# EAGLE design GPIO_Adapter (EAGLE 9.6.2)
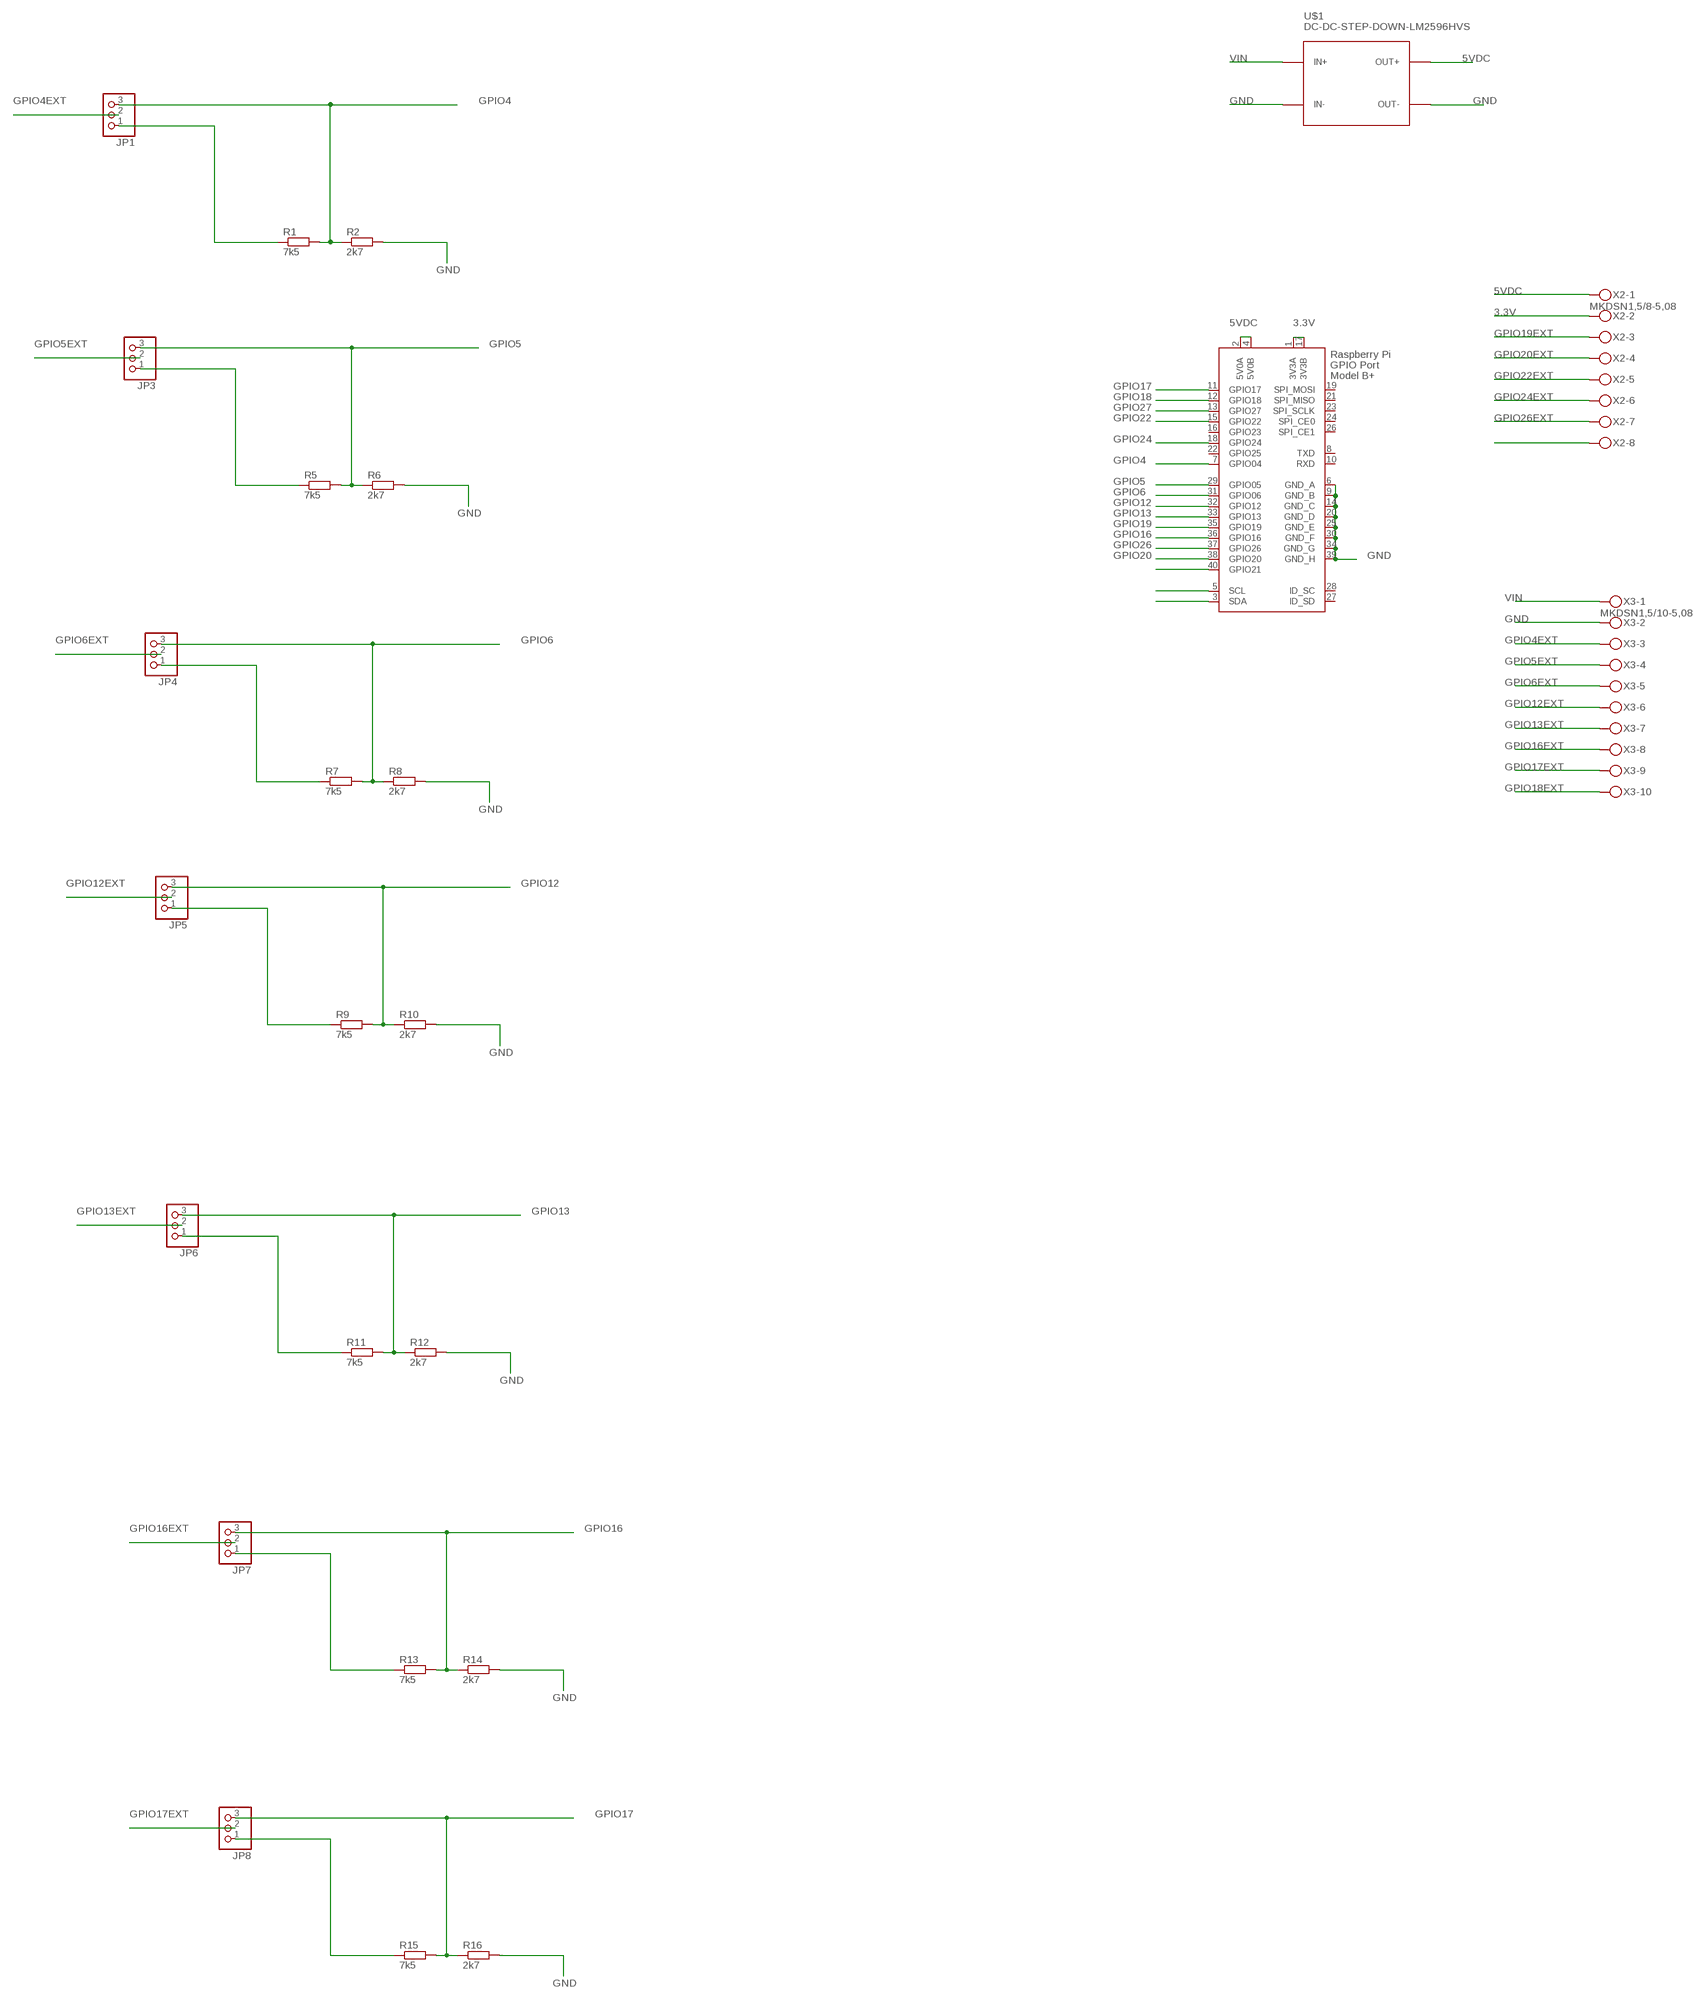
[diagram p0: schematic, sheet 1, part 1 of 2]
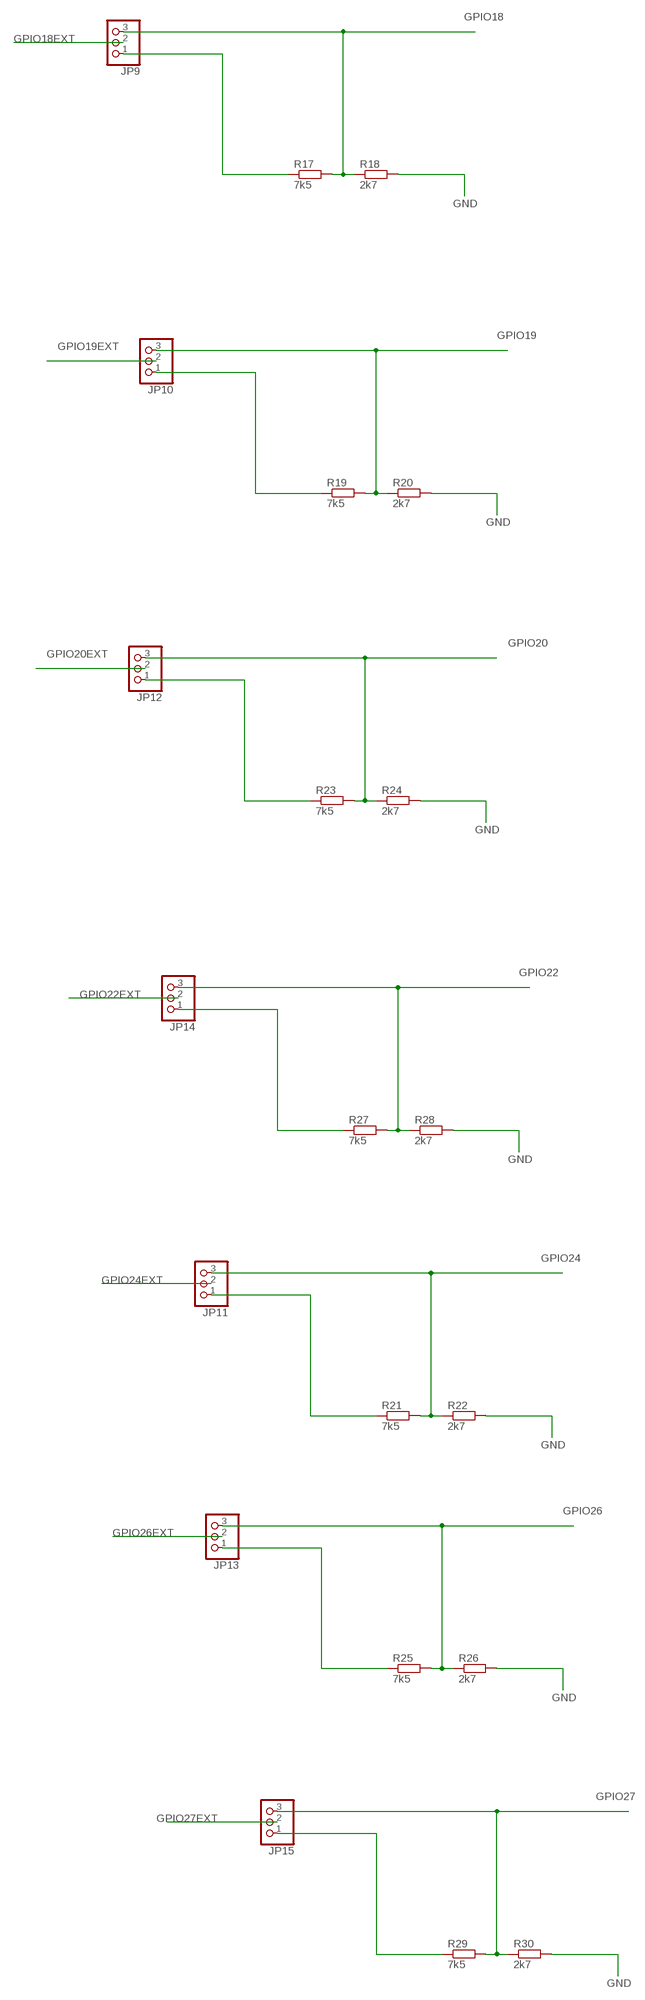
[diagram p1: schematic, sheet 1, part 2 of 2]

## Parts
JP1  PINHD-1X3  [1X03]
JP3  PINHD-1X3  [1X03]
JP4  PINHD-1X3  [1X03]
JP5  PINHD-1X3  [1X03]
JP6  PINHD-1X3  [1X03]
JP7  PINHD-1X3  [1X03]
JP8  PINHD-1X3  [1X03]
JP9  PINHD-1X3  [1X03]
JP10  PINHD-1X3  [1X03]
JP11  PINHD-1X3  [1X03]
JP12  PINHD-1X3  [1X03]
JP13  PINHD-1X3  [1X03]
JP14  PINHD-1X3  [1X03]
JP15  PINHD-1X3  [1X03]
R1  7k5  R-EU_R0805  [R0805]
R2  2k7  R-EU_R0805  [R0805]
R5  7k5  R-EU_R0805  [R0805]
R6  2k7  R-EU_R0805  [R0805]
R7  7k5  R-EU_R0805  [R0805]
R8  2k7  R-EU_R0805  [R0805]
R9  7k5  R-EU_R0805  [R0805]
R10  2k7  R-EU_R0805  [R0805]
R11  7k5  R-EU_R0805  [R0805]
R12  2k7  R-EU_R0805  [R0805]
R13  7k5  R-EU_R0805  [R0805]
R14  2k7  R-EU_R0805  [R0805]
R15  7k5  R-EU_R0805  [R0805]
R16  2k7  R-EU_R0805  [R0805]
R17  7k5  R-EU_R0805  [R0805]
R18  2k7  R-EU_R0805  [R0805]
R19  7k5  R-EU_R0805  [R0805]
R20  2k7  R-EU_R0805  [R0805]
R21  7k5  R-EU_R0805  [R0805]
R22  2k7  R-EU_R0805  [R0805]
R23  7k5  R-EU_R0805  [R0805]
R24  2k7  R-EU_R0805  [R0805]
R25  7k5  R-EU_R0805  [R0805]
R26  2k7  R-EU_R0805  [R0805]
R27  7k5  R-EU_R0805  [R0805]
R28  2k7  R-EU_R0805  [R0805]
R29  7k5  R-EU_R0805  [R0805]
R30  2k7  R-EU_R0805  [R0805]
U$1  DC-DC-STEP-DOWN-LM2596HVS  [DC-DC-STEP-DOWN-LM2596HVS]
X1  RASPI_BOARD_B+#_F  [RASPI_BOARD_B+_FULL]
X2  MKDSN1,5/8-5,08  [MKDSN1,5/8-5,08]
X3  MKDSN1,5/10-5,08  [MKDSN1,5/10-5,08]

## Nets
3.3V: X1.1(3V3A) X1.17(3V3B) X2.2
5VDC: U$1.OUT+ X1.2(5V0A) X1.4(5V0B) X2.1
GND: R2.2 R6.2 R8.2 R10.2 R12.2 R14.2 R16.2 R18.2 R20.2 R22.2 R24.2 R26.2 R28.2 R30.2 U$1.IN- U$1.OUT- X1.6(GND_A) X1.9(GND_B) X1.14(GND_C) X1.20(GND_D) X1.25(GND_E) X1.30(GND_F) X1.34(GND_G) X1.39(GND_H) X3.2
GPIO4: JP1.3 R1.2 R2.1 X1.7(GPIO04)
GPIO4EXT: JP1.2 X3.3
GPIO5: JP3.3 R5.2 R6.1 X1.29(GPIO05)
GPIO5EXT: JP3.2 X3.4
GPIO6: JP4.3 R7.2 R8.1 X1.31(GPIO06)
GPIO6EXT: JP4.2 X3.5
GPIO12: JP5.3 R9.2 R10.1 X1.32(GPIO12)
GPIO12EXT: JP5.2 X3.6
GPIO13: JP6.3 R11.2 R12.1 X1.33(GPIO13)
GPIO13EXT: JP6.2 X3.7
GPIO16: JP7.3 R13.2 R14.1 X1.36(GPIO16)
GPIO16EXT: JP7.2 X3.8
GPIO17: JP8.3 R15.2 R16.1 X1.11(GPIO17)
GPIO17EXT: JP8.2 X3.9
GPIO18: JP9.3 R17.2 R18.1 X1.12(GPIO18)
GPIO18EXT: JP9.2 X3.10
GPIO19: JP10.3 R19.2 R20.1 X1.35(GPIO19)
GPIO19EXT: JP10.2 X2.3
GPIO20: JP12.3 R23.2 R24.1 X1.38(GPIO20)
GPIO20EXT: JP12.2 X2.4
GPIO22: JP14.3 R27.2 R28.1 X1.15(GPIO22)
GPIO22EXT: JP14.2 X2.5
GPIO24: JP11.3 R21.2 R22.1 X1.18(GPIO24)
GPIO24EXT: JP11.2 X2.6
GPIO26: JP13.3 R25.2 R26.1 X1.37(GPIO26)
GPIO26EXT: JP13.2 X2.7
GPIO27: JP15.3 R29.2 R30.1 X1.13(GPIO27)
GPIO27EXT: JP15.2 X2.8
N$9: JP1.1 R1.1
N$21: JP3.1 R5.1
N$24: JP4.1 R7.1
N$27: JP5.1 R9.1
N$30: JP6.1 R11.1
N$33: JP7.1 R13.1
N$36: JP8.1 R15.1
N$39: JP9.1 R17.1
N$42: JP10.1 R19.1
N$45: JP11.1 R21.1
N$48: JP12.1 R23.1
N$51: JP13.1 R25.1
N$54: JP14.1 R27.1
N$57: JP15.1 R29.1
N$75: X1.40(GPIO21)
N$76: X1.5(SCL)
N$77: X1.3(SDA)
VIN: U$1.IN+ X3.1
Unconnected: X1.8(TXD) X1.10(RXD) X1.16(GPIO23) X1.19(SPI_MOSI) X1.21(SPI_MISO) X1.22(GPIO25) X1.23(SPI_SCLK) X1.24(SPI_CE0) X1.26(SPI_CE1) X1.27(ID_SD) X1.28(ID_SC)

## Library data of the parts
JP1 JP3-JP15 = pinhead:PINHD-1X3: PIN HEADER
R1 R2 R5-R30 = rcl:R-EU_: RESISTOR, European symbol
U$1 = diy-modules:DC-DC-STEP-DOWN-LM2596HVS: DC/DC Step-Down Regulator based on LM2596-ADJ chip LM2596 datasheet available here: http://www.ti.com/lit/ds/symlink/lm2596.pdf Click here to find device on ebay.com <http://www.ebay.com/sch/lm2596+power+regulator>
X1 = raspberrypi_bastelstube_v13:RASPI_BOARD_B+#: Raspberry Pi GPIO connector with markings for the outer dimensions of the Raspberry Pi board model B+ with different sets of drill holes or mounting pads All pins connected
X2 = con-phoenix-508:MKDSN1,5/8-5,08: MKDSN 1,5/ 8-5,08 Printklemme Nennstrom: 13,5 A Nennspannung: 250 V Rastermaß: 5,08 mm Polzahl: 8 Anschlussart: Schraubanschluss Montage: Löten Anschlussrichtung Leiter/Platine: 0 ° Artikelnummer: 1729186 Source: http://eshop.phoenixcontact.com .. 1729186.pdf
X3 = con-phoenix-508:MKDSN1,5/10-5,08: MKDSN 1,5/10-5,08 Printklemme Nennstrom: 13,5 A Nennspannung: 250 V Rastermaß: 5,08 mm Polzahl: 10 Anschlussart: Schraubanschluss Montage: Löten Anschlussrichtung Leiter/Platine: 0 ° Artikelnummer: 1729209 Source: http://eshop.phoenixcontact.com .. 1729209.pdf

## Board
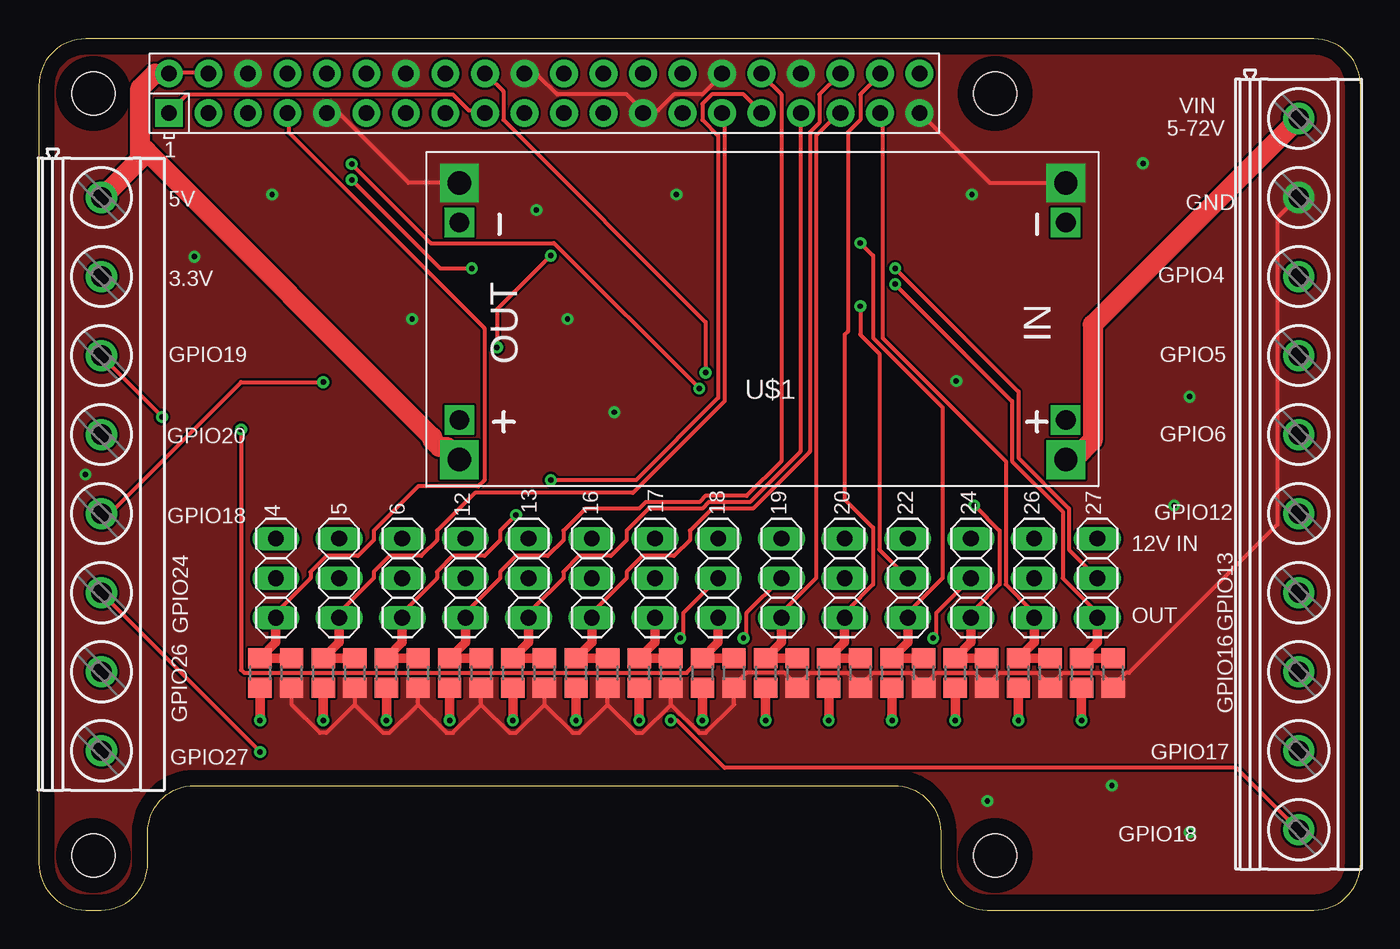
[diagram p2: board, top side]
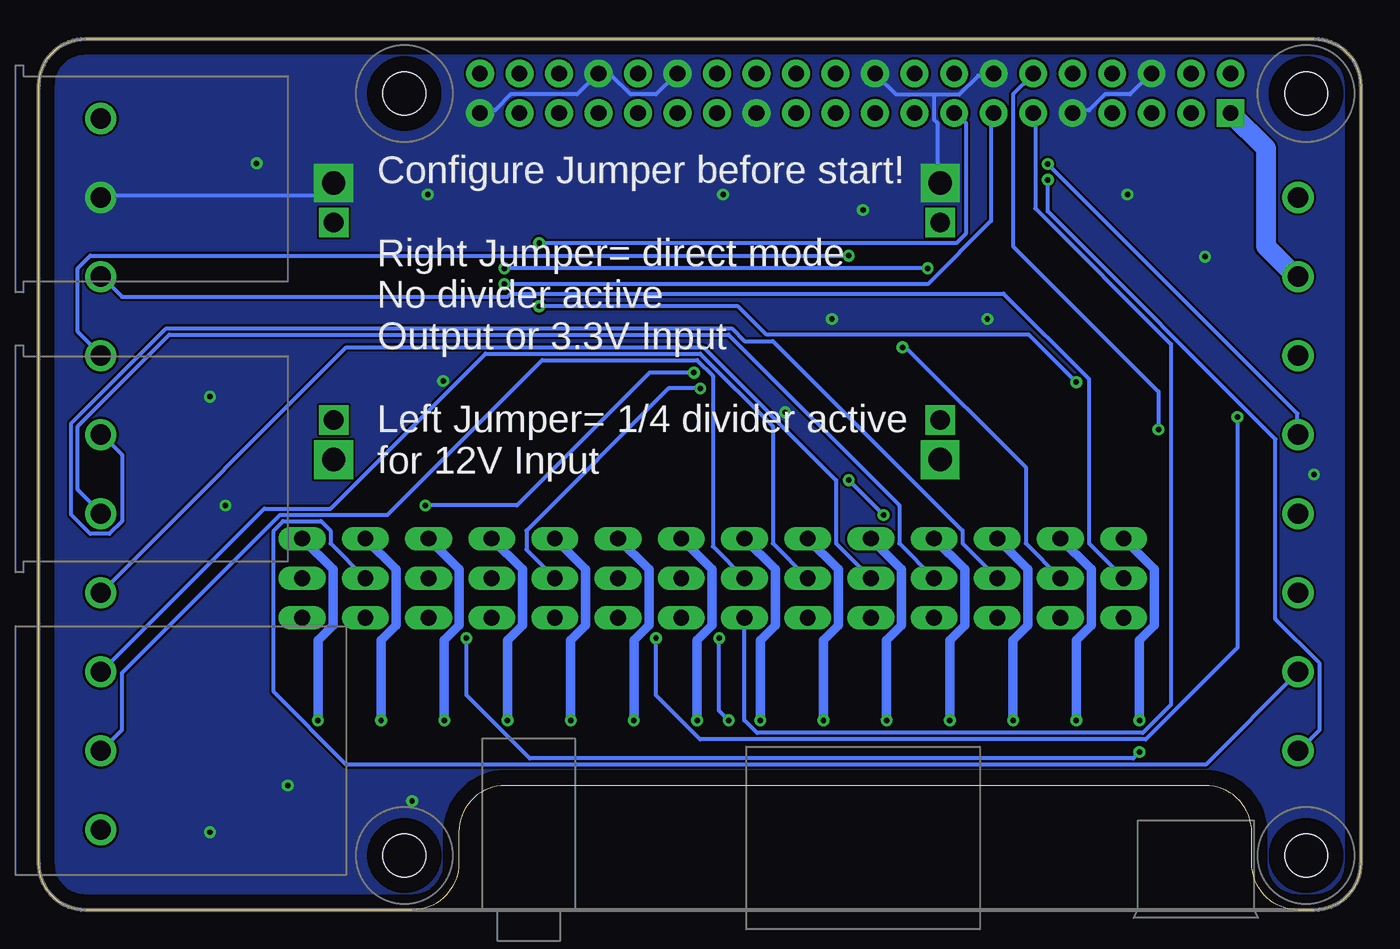
[diagram p3: board, bottom side, seen from below]

Size 85 x 56 mm. Coordinates in mm from the lower left corner, seen from the top.
Outline: 82,56 3,56 arc90 0,53 0,3 arc90 3,0 4,0 arc90 7,3 7,5 arc-90 10,8 55,8 arc-90 58,5 58,3 arc90 61,0 82,0 arc90 85,3 85,53 arc90 82,56
Copper layers (1*16): Top 0.035mm / dielectric 1.5mm / Bottom 0.035mm
Design rules "default *": minimum track width 10mil, minimum drill 0.35mm, track to track 6mil, track to pad 6mil, pad to pad 6mil, via to via 6mil, smd to smd 6mil, copper to edge 40mil, drill to drill 6mil, minimum pad ring 10mil, minimum via ring 8mil, stop-mask expansion 4mil, vias tented up to drill 0mil, thermal gap 10mil

### Footprints (pad centres in the part's own frame; a part is rotated, then mirrored left to right if it is on the bottom)
1X03 = drill 1.016 long: 1 -2.54,0; 2 0,0; 3 2.54,0
R0805 = smd 1.3 x 1.5: 1 -0.95,0; 2 0.95,0
DC-DC-STEP-DOWN-LM2596HVS = drill 1.5 pad 2.5 square: IN+ 0,17.78; IN- 0,0; OUT+ 39,17.78; OUT- 39,0 | drill 1.27 pad 1.676 square: P$1 0,15.24; P$6 0,2.54; P$7 39,15.24; P$8 39,2.54
RASPI_BOARD_B+_FULL = drill 1 pad 1.778 square: 1 8.37,51.23 | drill 1 pad 1.778: 2 8.37,53.77; 3 10.91,51.23; 4 10.91,53.77; 5 13.45,51.23; 6 13.45,53.77; 7 15.99,51.23; 8 15.99,53.77; 9 18.53,51.23; 10 18.53,53.77; 11 21.07,51.23; 12 21.07,53.77; 13 23.61,51.23; 14 23.61,53.77; 15 26.15,51.23; 16 26.15,53.77; 17 28.69,51.23; 18 28.69,53.77; 19 31.23,51.23; 20 31.23,53.77; 21 33.77,51.23; 22 33.77,53.77; 23 36.31,51.23; 24 36.31,53.77; 25 38.85,51.23; 26 38.85,53.77; 27 41.39,51.23; 28 41.39,53.77; 29 43.93,51.23; 30 43.93,53.77; 31 46.47,51.23; 32 46.47,53.77; 33 49.01,51.23; 34 49.01,53.77; 35 51.55,51.23; 36 51.55,53.77; 37 54.09,51.23; 38 54.09,53.77; 39 56.63,51.23; 40 56.63,53.77 | hole 2.75: 3.5,3.5; 3.5,52.5; 61.5,3.5; 61.5,52.5
MKDSN1,5/8-5,08 = drill 1.3 pad 2: 1 -17.801,0.025; 2 -12.721,0.025; 3 -7.641,0.025; 4 -2.561,0.025; 5 2.519,0.025; 6 7.599,0.025; 7 12.679,0.025; 8 17.759,0.025
MKDSN1,5/10-5,08 = drill 1.3 pad 2: 1 -22.881,0.025; 2 -17.801,0.025; 3 -12.721,0.025; 4 -7.641,0.025; 5 -2.561,0.025; 6 2.519,0.025; 7 7.599,0.025; 8 12.679,0.025; 9 17.759,0.025; 10 22.839,0.025

### Placement (x,y rotation side)
JP1  15.24,21.34 270 top
JP3  19.3,21.34 270 top
JP4  23.37,21.34 270 top
JP5  27.43,21.34 270 top
JP6  31.5,21.34 270 top
JP7  35.56,21.34 270 top
JP8  39.62,21.34 270 top
JP9  43.69,21.34 270 top
JP10  47.75,21.34 270 top
JP11  59.94,21.34 270 top
JP12  51.82,21.34 270 top
JP13  64.01,21.34 270 top
JP14  55.88,21.34 270 top
JP15  68.07,21.34 270 top
R1  14.22,15.24 90 top
R2  16.26,15.24 270 top
R5  18.29,15.24 90 top
R6  20.32,15.24 270 top
R7  22.35,15.24 90 top
R8  24.38,15.24 270 top
R9  26.42,15.24 90 top
R10  28.45,15.24 270 top
R11  30.48,15.24 90 top
R12  32.51,15.24 270 top
R13  34.54,15.24 90 top
R14  36.58,15.24 270 top
R15  38.61,15.24 90 top
R16  40.64,15.24 270 top
R17  42.67,15.24 90 top
R18  44.7,15.24 270 top
R19  46.74,15.24 90 top
R20  48.77,15.24 270 top
R21  58.93,15.24 90 top
R22  60.96,15.24 270 top
R23  50.8,15.24 90 top
R24  52.83,15.24 270 top
R25  62.99,15.24 90 top
R26  65.02,15.24 270 top
R27  54.86,15.24 90 top
R28  56.9,15.24 270 top
R29  67.06,15.24 90 top
R30  69.09,15.24 270 top
U$1  66.04,46.74 180 top
X1  0,0 0 top
X2  4,28 270 top
X3  81,28 270 top

### Tracks (layer width: path | path; a pad name or v marks a point on that pad's centre or on a via)
3.3V
  Top 0.254: X1.17 28.65,51.41 27.64,51.41 26.62,52.43 9.55,52.43 8.53,51.41 X1.1
  Bottom 1.27: X1.1 6.1,48.96 6.1,42.67 4.14,40.72 X2.2
5VDC
  Top 0.254: X1.4 10.77,53.85 8.94,53.85 X1.2
  Top 1.016: 7.02,48.68 6.4,49.3 6.4,52.83 7.34,53.77 X1.2
  Top 1.27: X2.1 6.53,48.3 6.53,49.17 | X1.2 7.46,53.77 6.53,52.83 6.53,49.17 | U$1.OUT+ 26.24,29.76 25.76,29.76 25.3,30.22 25.3,30.4 7.02,48.68 6.53,49.17
GND  (via drill 0.35)
  Top 0.254: 48.77,14.43 47.95,15.24 45.52,15.24 44.7,14.43 R18.2 44.7,13.21 42.88,11.38 42.47,11.38 40.64,13.21 | 52.83,14.43 52.02,15.24 49.58,15.24 48.77,14.43 | 48.77,14.43 R20.2 | 56.9,14.43 56.08,15.24 53.65,15.24 52.83,14.43 | 52.83,14.43 R24.2 | 60.96,14.43 60.15,15.24 57.71,15.24 56.9,14.43 | 56.9,14.43 R28.2 | 65.02,14.43 64.21,15.24 61.77,15.24 60.96,14.43 | 60.96,14.43 R22.2 | 69.09,14.43 68.28,15.24 65.84,15.24 65.02,14.43 | 65.02,14.43 R26.2 | R2.2 16.26,13.21 18.09,11.38 18.49,11.38 20.32,13.21 | R6.2 20.32,13.21 | 24.38,13.21 R8.2 | 24.38,13.21 22.55,11.38 22.15,11.38 20.32,13.21 | 28.45,13.21 R10.2 | 28.45,13.21 26.62,11.38 26.21,11.38 24.38,13.21 | 32.51,13.21 R12.2 | 32.51,13.21 30.68,11.38 30.28,11.38 28.45,13.21 | 36.58,13.21 R14.2 | 36.58,13.21 34.75,11.38 34.34,11.38 32.51,13.21 | 40.64,13.21 R16.2 | 40.64,13.21 38.81,11.38 38.41,11.38 36.58,13.21 | U$1.OUT- 23.77,46.74 19.3,51.21 18.69,51.21 X1.9 | X1.30 43.89,53.65 42.67,52.43 40.84,52.43 39.83,51.41 39.01,51.41 X1.25 38.81,51.41 37.8,52.43 33.33,52.43 32.11,53.65 31.29,53.65 X1.20 | U$1.IN- 61.16,46.74 56.69,51.21 X1.39 | 69.09,14.43 69.9,15.24 70.1,15.24 79.65,24.79 79.65,44.5 80.87,45.72 X3.2 | 69.09,14.43 R30.2
  Bottom 0.254: X1.9 18.49,51.41 17.48,51.41 16.46,52.43 14.83,52.43 13.61,53.65 X1.6 | 27.43,52.43 29.87,52.43 31.09,53.65 X1.20 | 27.43,52.43 25.81,52.43 24.59,53.65 23.77,53.65 X1.14 | 27.43,52.43 27.43,50.8 27.23,50.6 27.23,46.74 U$1.OUT- | U$1.IN- 66.85,45.92 80.87,45.92 X3.2 | X1.30 44.09,53.65 45.31,52.43 46.94,52.43 48.16,53.65 48.97,53.65 X1.34 49.17,53.65 50.39,52.43 54.66,52.43 55.68,51.41 56.49,51.41 X1.39
  other vias: 15,46 10,42 32,45 41,46 24,38 34,38 37,32 3,28 69,8 74,33 71,48 60,46 74,5 61,7 73,26 59,34
  pour Top (no thermals): -1,60 87,60 87,-2 -1,-2
  pour Bottom (no thermals): -3,58 88,58 88,-3 -3,-3
GPIO4
  Top 0.254: JP1.3 15.44,18.9 15.44,19.3 17.48,21.34 17.48,21.74 18.49,22.76 20.52,22.76 21.54,23.77 21.54,24.38 24.38,27.23 28.25,27.23 28.65,27.64 28.65,37.39 16.05,49.99 16.05,51.21 X1.7
  Top 0.61: R2.1 R1.2 15.24,17.21 JP1.3
GPIO4EXT
  Bottom 0.254: JP1.2 17.48,23.57 17.48,34.14 22.96,39.62 54.66,39.62 54.86,39.42 79.65,39.42 80.87,40.64 X3.3
GPIO5
  Top 0.254: JP3.3 19.51,18.9 19.51,19.3 21.54,21.34 21.54,21.74 22.55,22.76 24.59,22.76 25.6,23.77 25.6,24.38 28.04,26.82 38.2,26.82 44.09,32.72 44.09,51.21 X1.29
  Top 0.61: R6.1 R5.2 19.3,17.21 JP3.3
GPIO5EXT  (via drill 0.35)
  Top 0.254: v29.46,36.17 29.46,38.61 v32.92,42.06
  Bottom 0.254: JP3.2 21.54,23.57 21.54,28.45 29.26,36.17 v29.46,36.17 | v32.92,42.06 81.69,42.06 82.5,41.25 82.5,37.19 81.08,35.76 X3.4
GPIO6  (via drill 0.35)
  Top 0.254: v30.68,25.4 29.67,24.38 29.67,23.77 28.65,22.76 26.62,22.76 25.6,21.74 25.6,21.34 23.57,19.3 23.57,18.9 JP4.3 | v32.92,27.64 38.41,27.64 43.69,32.92 43.69,49.78 42.67,50.8 42.67,51.82 43.28,52.43 45.31,52.43 46.33,51.41 X1.31
  Top 0.61: R8.1 R7.2 23.37,17.21 JP4.3
  Bottom 0.254: v32.92,27.64 v30.68,25.4
GPIO6EXT
  Bottom 0.254: JP4.2 25.6,23.57 25.6,24.38 37.8,36.58 39.62,36.58 40.44,37.39 76.81,37.39 82.91,31.29 82.91,25.4 81.69,24.18 80.47,24.18 79.65,24.99 79.65,29.26 80.87,30.48 X3.5
GPIO12
  Top 0.254: JP5.3 27.64,18.9 27.64,19.3 29.67,21.34 29.67,21.74 30.68,22.76 32.72,22.76 33.73,23.77 33.73,24.38 35.15,25.81 38.61,25.81 39.01,26.21 42.47,26.21 42.88,26.62 45.52,26.62 47.75,28.85 47.75,52.43 46.53,53.65 X1.32
  Top 0.61: R10.1 R9.2 27.43,17.21 JP5.3
GPIO12EXT
  Bottom 0.254: JP5.2 29.67,23.57 29.67,26.01 40.64,36.98 76.61,36.98 82.5,31.09 82.5,27.03 81.08,25.6 X3.6
GPIO13
  Top 0.254: JP6.3 31.7,18.9 31.7,19.3 33.73,21.34 33.73,21.74 34.75,22.76 36.78,22.76 37.8,23.77 37.8,24.38 39.22,25.81 42.67,25.81 43.08,26.21 45.72,26.21 48.97,29.46 48.97,51.21 X1.33
  Top 0.61: R12.1 R11.2 31.5,17.21 JP6.3
GPIO13EXT
  Bottom 0.254: JP6.2 33.73,23.57 33.73,27.64 42.27,36.17 65.23,36.17 80.87,20.52 X3.7
GPIO16
  Top 0.254: JP7.3 35.76,18.9 35.76,19.3 37.8,21.34 37.8,21.74 38.81,22.76 40.84,22.76 41.86,23.77 41.86,24.38 43.28,25.81 45.92,25.81 49.58,29.46 49.58,49.99 50.19,50.6 50.19,52.43 51.41,53.65 X1.36
  Top 0.61: R14.1 R13.2 35.56,17.21 JP7.3
GPIO16EXT
  Bottom 0.254: JP7.2 37.8,23.57 37.8,31.09 42.47,35.76 56.29,35.76 66.24,25.81 70.51,25.81 80.87,15.44 X3.8
GPIO17
  Top 0.61: R16.1 R15.2 39.62,17.21 JP8.3
  Bottom 0.254: JP8.3 39.62,12.19 38.81,11.38 14.02,11.38 12.19,13.21 12.19,36.37 20.93,45.11 20.93,51.21 X1.11
GPIO17EXT
  Bottom 0.254: JP8.2 41.66,23.37 41.66,34.34 42.67,35.36 52.63,35.36 62.59,25.4 69.49,25.4 79.65,15.24 79.65,11.58 80.87,10.36 X3.9
GPIO18  (via drill 0.35)
  Top 0.254: v13.01,30.89 13.01,15.44 13.21,15.24 41.66,15.24 42.47,16.05 R17.2
  Top 0.61: R18.1 R17.2 43.69,17.21 JP9.3
  Bottom 0.254: v13.01,30.89 13.01,33.33 22.35,42.67 22.35,52.43 21.13,53.65 X1.12
GPIO18EXT  (via drill 0.35)
  Top 0.254: JP9.2 41.45,19.1 41.45,17.68 v41.25,17.48 | v40.64,12.19 41.05,12.19 44.09,9.14 77.01,9.14 80.87,5.28 X3.10
  Bottom 0.254: v41.25,17.48 41.25,12.8 v40.64,12.19
GPIO19
  Top 0.254: JP10.3 47.95,18.9 47.95,19.3 49.99,21.34 49.99,49.78 51.41,51.21 X1.35
  Top 0.61: R20.1 R19.2 47.75,17.21 JP10.3
GPIO19EXT  (via drill 0.35)
  Top 0.254: JP10.2 45.52,19.1 45.52,17.68 v45.31,17.48 | v7.92,31.7 4.06,35.56 X2.3
  Bottom 0.254: v45.31,17.48 45.31,13.82 42.47,10.97 13.82,10.97 7.92,16.87 v7.92,31.7
GPIO20
  Top 0.254: JP12.3 52.02,18.9 52.02,19.3 53.65,20.93 53.65,24.59 51.82,26.42 51.82,36.98 52.02,37.19 52.02,49.99 52.83,50.8 52.83,52.43 54.05,53.65 X1.38
  Top 0.61: R24.1 R23.2 51.82,17.21 JP12.3
GPIO20EXT  (via drill 0.35)
  Top 0.254: v42.47,33.53 33.12,42.88 25.2,42.88 v20.12,47.95
  Bottom 0.254: JP12.2 53.65,23.16 53.65,24.38 44.5,33.53 v42.47,33.53 | v20.12,47.95 4.06,31.9 4.06,30.68 X2.4
GPIO22  (via drill 0.35)
  Top 0.254: v52.83,42.88 53.65,42.06 53.65,36.78 58.12,32.31 58.12,21.34 56.08,19.3 56.08,18.9 JP14.3
  Top 0.61: R28.1 R27.2 55.88,17.21 JP14.3
  Bottom 0.254: v52.83,42.88 26.01,42.88 25.4,43.48 25.4,50.6 26.01,51.21 X1.15
GPIO22EXT  (via drill 0.35)
  Top 0.254: JP14.2 54.05,23.16 54.05,35.76 52.83,36.98 v52.83,38.81 | v18.29,33.93 13.01,33.93 4.67,25.6 4.06,25.6 X2.5
  Bottom 0.254: v52.83,38.81 40.03,38.81 38.2,36.98 21.34,36.98 v18.29,33.93
GPIO24  (via drill 0.35)
  Top 0.254: v60.15,26.01 61.77,24.38 61.77,20.93 60.15,19.3 60.15,18.9 JP11.3 | v42.88,34.54 42.88,37.8 29.87,50.8 29.87,52.63 28.85,53.65 X1.18
  Top 0.61: R22.1 R21.2 59.94,17.21 JP11.3
  Bottom 0.254: v60.15,26.01 54.25,26.01 45.72,34.54 v42.88,34.54
GPIO24EXT  (via drill 0.35)
  Top 0.254: JP11.2 57.71,19.1 57.71,17.68 v57.51,17.48 | v14.22,10.16 4.06,20.32 X2.6
  Bottom 0.254: v57.51,17.48 57.51,13.82 53.44,9.75 14.63,9.75 v14.22,10.16
GPIO26
  Top 0.254: JP13.3 63.8,18.9 63.8,19.3 62.18,20.93 62.18,28.85 54.25,36.78 54.25,51.21 X1.37
  Top 0.61: R26.1 R25.2 64.01,17.21 JP13.3
GPIO26EXT
  Bottom 0.254: JP13.2 66.24,23.57 66.24,24.38 66.85,24.99 69.29,24.99 69.9,24.38 69.9,14.02 65.23,9.35 9.96,9.35 4.06,15.24 X2.7
GPIO27  (via drill 0.35)
  Top 0.254: v55.07,40.23 62.59,32.72 62.59,28.85 65.84,25.6 65.84,21.34 67.87,19.3 67.87,18.9 JP15.3
  Top 0.61: R30.1 R29.2 68.07,17.21 JP15.3
  Bottom 0.254: v55.07,40.23 27.84,40.23 23.77,44.3 23.77,51.21 X1.13
GPIO27EXT  (via drill 0.35)
  Top 0.254: JP15.2 66.24,23.16 66.24,25.81 62.99,29.06 62.99,33.33 v55.07,41.25 | v27.84,41.25 25.81,41.25 v20.12,46.94
  Bottom 0.254: v27.84,41.25 v55.07,41.25 | v20.12,46.94 20.12,44.91 5.49,30.28 5.49,18.69 2.64,15.85 2.64,11.58 3.86,10.36 X2.8
N$9  (via drill 0.35)
  Top 0.61: R1.1 v14.22,12.19
  Bottom 0.61: v14.22,12.19 14.22,17.33 13.26,18.29 13.26,21.89 JP1.1
N$21  (via drill 0.35)
  Top 0.61: R5.1 v18.29,12.19
  Bottom 0.61: v18.29,12.19 18.29,17.33 17.32,18.29 17.32,21.89 JP3.1
N$24  (via drill 0.35)
  Top 0.61: R7.1 v22.35,12.19
  Bottom 0.61: v22.35,12.19 22.35,17.33 21.39,18.29 21.39,21.89 JP4.1
N$27  (via drill 0.35)
  Top 0.61: R9.1 v26.42,12.19
  Bottom 0.61: v26.42,12.19 26.42,17.33 25.45,18.29 25.45,21.89 JP5.1
N$30  (via drill 0.35)
  Top 0.61: R11.1 v30.48,12.19
  Bottom 0.61: v30.48,12.19 30.48,17.33 29.52,18.29 29.52,21.89 JP6.1
N$33  (via drill 0.35)
  Top 0.61: R13.1 v34.54,12.19
  Bottom 0.61: v34.54,12.19 34.54,17.33 33.58,18.29 33.58,21.89 JP7.1
N$36  (via drill 0.35)
  Top 0.61: R15.1 v38.61,12.19
  Bottom 0.61: v38.61,12.19 38.61,17.33 37.64,18.29 37.64,21.89 JP8.1
N$39  (via drill 0.35)
  Top 0.61: R17.1 v42.67,12.19
  Bottom 0.61: v42.67,12.19 42.67,17.33 41.71,18.29 41.71,21.89 JP9.1
N$42  (via drill 0.35)
  Top 0.61: R19.1 v46.74,12.19
  Bottom 0.61: v46.74,12.19 46.74,17.33 45.77,18.29 45.77,21.89 JP10.1
N$45  (via drill 0.35)
  Top 0.61: R21.1 v58.93,12.19
  Bottom 0.61: v58.93,12.19 58.93,17.33 57.96,18.29 57.96,21.89 JP11.1
N$48  (via drill 0.35)
  Top 0.61: R23.1 v50.8,12.19
  Bottom 0.61: v50.8,12.19 50.8,17.33 49.84,18.29 49.84,21.89 JP12.1
N$51  (via drill 0.35)
  Top 0.61: R25.1 v62.99,12.19
  Bottom 0.61: v62.99,12.19 62.99,17.33 62.03,18.29 62.03,21.89 JP13.1
N$54  (via drill 0.35)
  Top 0.61: R27.1 v54.86,12.19
  Bottom 0.61: v54.86,12.19 54.86,17.33 53.9,18.29 53.9,21.89 JP14.1
N$57  (via drill 0.35)
  Top 0.61: R29.1 v67.06,12.19
  Bottom 0.61: v67.06,12.19 67.06,17.33 66.09,18.29 66.09,21.89 JP15.1
VIN
  Top 1.27: X3.1 67.78,37.64 67.78,30.19 66.55,28.96 U$1.IN+

### Text on the board
tNames: VIN | 5-72V | 5V | GND | 3.3V | GPIO4 | GPIO19 | GPIO5 | GPIO20 | GPIO6 | 13 | 17 | GPIO18 | 4 | 5 | 6 | 12 | 16 | 18 | 19 | 20 | 22 | 24 | 26 | 27 | GPIO12 | 12V IN | GPIO24 | OUT | GPIO13 | GPIO16 | GPIO26 | GPIO17 | GPIO27 | GPIO18
bNames: Configure Jumper before start! / / Right Jumper= direct mode / No divider active / Output or 3.3V Input / / Left Jumper= 1/4 divider active / for 12V Input